# Altium project CANSAT-Measurement-SENS.PrjPcb
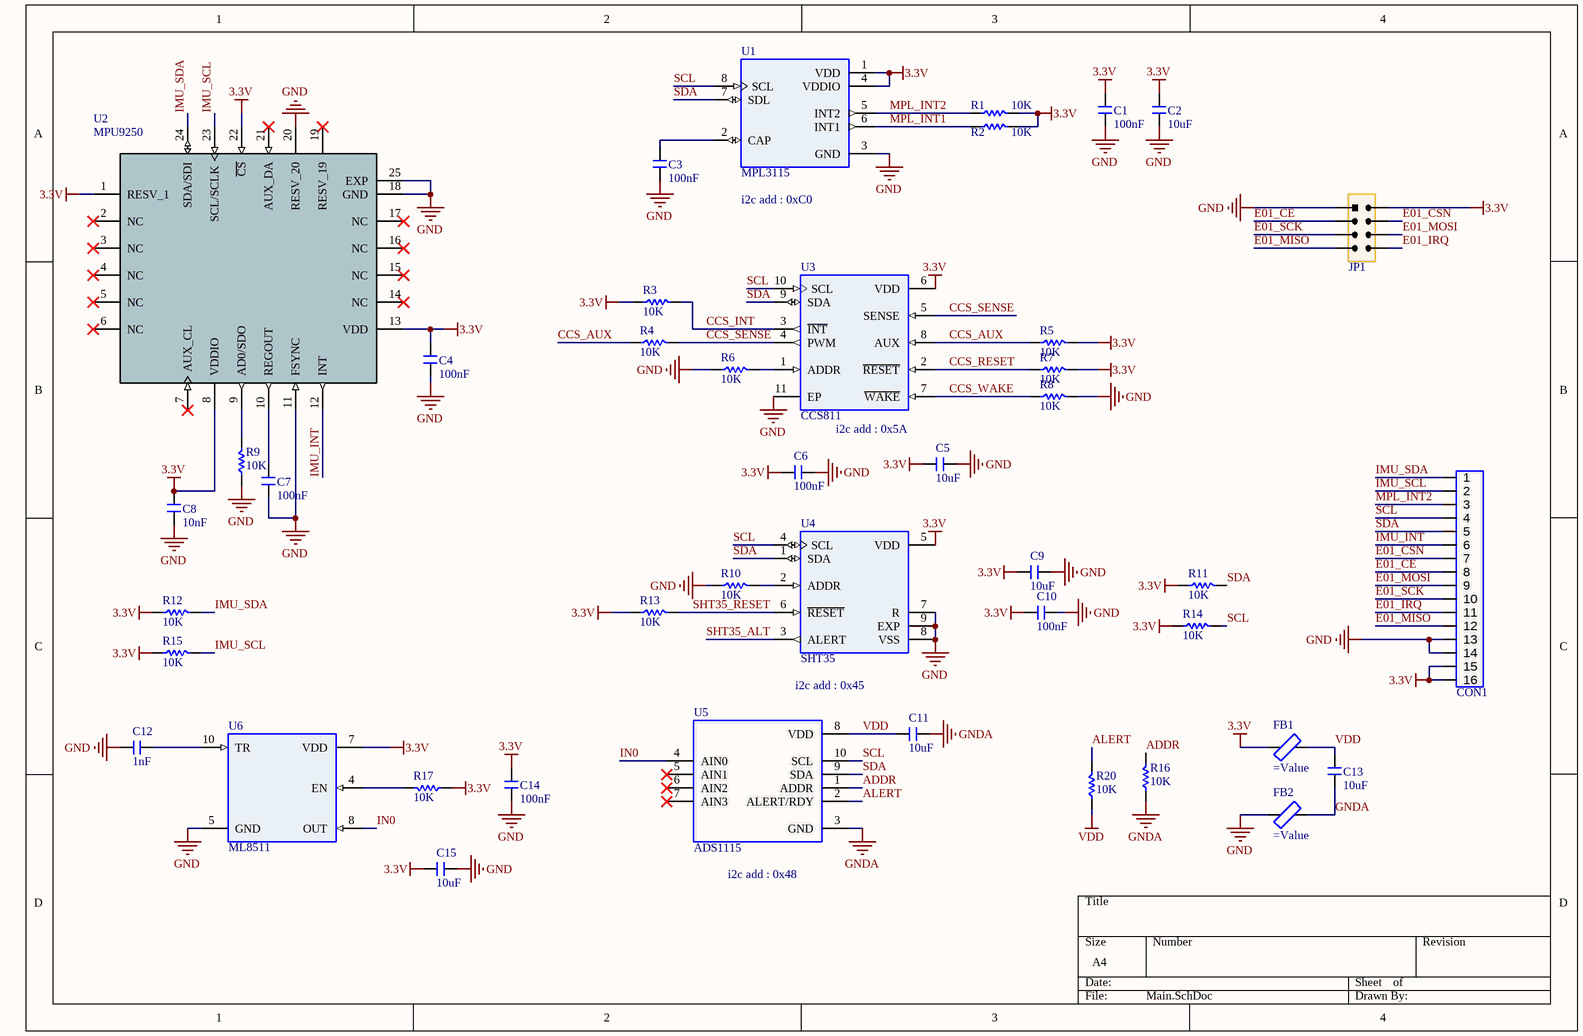
[diagram p0: Main.SchDoc]
1 sheet, 43 parts. Net scope: global (net labels, ports and power ports of the same name join across sheets).
Board file: CANSAT-Measurement-SENS PCB.PcbDoc

## Sheet Main.SchDoc
size A4; SheetNumber: 1; SheetTotal: 1

### Parts
C1  100nF  [C 0603]
C2  10uF  [C 0603]
C3  100nF  [C 0603]
C4  100nF  [C 0603]
C5  10uF  [C 0603]
C6  100nF  [C 0603]
C7  100nF  [C 0603]
C8  10nF  [C 0603]
C9  10uF  [C 0603]
C10  100nF  [C 0603]
C11  10uF  [C 0603]
C12  1nF  [C 0603]
C13  10uF  [C 0603]
C14  100nF  [C 0603]
C15  10uF  [C 0603]
CON1  FFC_0.5_16  [FFC_0.5_16]  (value not drawn)
FB1  (no value)  [F 0603]
FB2  (no value)  [F 0603]
JP1  Header 4X2  [HDR-4X2]  (value not drawn)
R1  10K  [R 0603]
R2  10K  [R 0603]
R3  10K  [R 0603]
R4  10K  [R 0603]
R5  10K  [R 0603]
R6  10K  [R 0603]
R7  10K  [R 0603]
R8  10K  [R 0603]
R9  10K  [R 0603]
R10  10K  [R 0603]
R11  10K  [R 0603]
R12  10K  [R 0603]
R13  10K  [R 0603]
R14  10K  [R 0603]
R15  10K  [R 0603]
R16  10K  [R 0603]
R17  10K  [R 0603]
R20  10K  [R 0603]
U1  MPL3115  [MPL3115]
U2  MPU9250  [QFN40-25N]
U3  CCS811  [CCS811]
U4  SHT35  [SHT35]
U5  ADS1115  [VSSOP10-N]
U6  ML8511  [ML8511]

### Nets
3.3V: C1.2 C2.2 C4.1 C5.2 C6.1 C8.1 C9.2 C10.1 C14.2 C15.2 CON1.15 CON1.16 FB1.1 JP1.2 R1.2 R2.2 R3.1 R5.2 R7.2 R11.1 R12.1 R13.1 R14.1 R15.1 R17.1 U1.1(VDD) U1.4(VDDIO) U2.1(RESV_1) U2.8(VDDIO) U2.13(VDD) U2.22(~{CS}) U3.6(VDD) U4.5(VDD) U6.7(VDD)
GND: C1.1 C2.1 C3.1 C4.2 C5.1 C6.2 C7.2 C8.2 C9.1 C10.2 C12.1 C14.1 C15.1 CON1.13 CON1.14 FB2.1 JP1.1 R6.1 R8.2 R9.1 R10.1 U1.3(GND) U2.11(FSYNC) U2.18(GND) U2.20(RESV_20) U2.25(EXP) U3.11(EP) U4.7(R) U4.8(VSS) U4.9(EXP) U6.5(GND)
GNDA: C11.1 C13.2 FB2.2 R16.1 U5.3(GND)
VDD: C11.2 C13.1 FB1.2 R20.1 U5.8(VDD)
ADDR: R16.2 U5.1(ADDR)
ALERT: R20.2 U5.2(ALERT/RDY)
CCS_AUX: R4.1 R5.1 U3.8(AUX)
CCS_INT: R3.2 U3.3(~{INT})
CCS_RESET: R7.1 U3.2(~{RESET})
CCS_SENSE: R4.2 U3.4(PWM) U3.5(SENSE)
CCS_WAKE: R8.1 U3.7(~{WAKE})
E01_CE: CON1.8 JP1.3
E01_CSN: CON1.7 JP1.4
E01_IRQ: CON1.11 JP1.8
E01_MISO: CON1.12 JP1.7
E01_MOSI: CON1.9 JP1.6
E01_SCK: CON1.10 JP1.5
IMU_INT: CON1.6 U2.12(INT)
IMU_SCL: CON1.2 R15.2 U2.23(SCL/SCLK)
IMU_SDA: CON1.1 R12.2 U2.24(SDA/SDI)
IN0: U5.4(AIN0) U6.8(OUT)
MPL_INT1: R2.1 U1.6(INT1)
MPL_INT2: CON1.3 R1.1 U1.5(INT2)
SCL: CON1.4 R14.2 U1.8(SCL) U3.10(SCL) U4.4(SCL) U5.10(SCL)
SDA: CON1.5 R11.2 U1.7(SDL) U3.9(SDA) U4.1(SDA) U5.9(SDA)
SHT35_ALT: U4.3(ALERT)
SHT35_RESET: R13.2 U4.6(~{RESET})
NetC3_2: C3.2 U1.2(CAP)
NetC7_1: C7.1 U2.10(REGOUT)
NetC12_2: C12.2 U6.10(TR)
NetR6_2: R6.2 U3.1(ADDR)
NetR9_2: R9.2 U2.9(AD0/SDO)
NetR10_2: R10.2 U4.2(ADDR)
NetR17_2: R17.2 U6.4(EN)

Not connected (* = marked no-connect by the designer): U2 2(NC)* 3(NC)* 4(NC)* 5(NC)* 6(NC)* 7(AUX_CL)* 14(NC)* 15(NC)* 16(NC)* 17(NC)* 19(RESV_19)* 21(AUX_DA)*; U5 5(AIN1)* 6(AIN2)* 7(AIN3)*

### Notes on the sheet
- (near U1) i2c add : 0xC0
- i2c add : 0x5A
- i2c add : 0x45
- (near U5) i2c add : 0x48

### Library data of the parts
C1-C15 = C: Non-polar patch capacitor; BOM名称: 无极性贴片电容; 版权归属: 源创客; 学习资源: www.ooocke.com
CON1 = FFC_0.5_16: FFC
FB1 FB2 = FB: Ferrite Bead; BOM名称: 贴片电阻; 版权归属: 源创客; 学习资源: www.ooocke.com
JP1 = Header 4X2: 4*2P Connector; BOM名称: 4*2P接插件; 版权归属: 源创客; 学习资源: www.ooocke.com
R1-R17 R20 = R: Chip resistor; 版权归属: 源创客; BOM名称: Chip resistor; 学习资源: www.ooocke.com
U1 = MPL3115: Pressure Sensor
U5 = ADS1115: ADS111x Ultra-Small, Low-Power, I / 2C-Compatible, 860-SPS, 16-Bit ADCs / With Internal Reference, Oscillator, and Programmable Comparator; BOM名称: 数字电位器; 版权归属: 源创客; 学习资源: www.ooocke.com
U6 = ML8511: UV Sensor